# Altium schematic sheet leds.SchDoc
size A; SheetNumber: 4; SheetTotal: 4
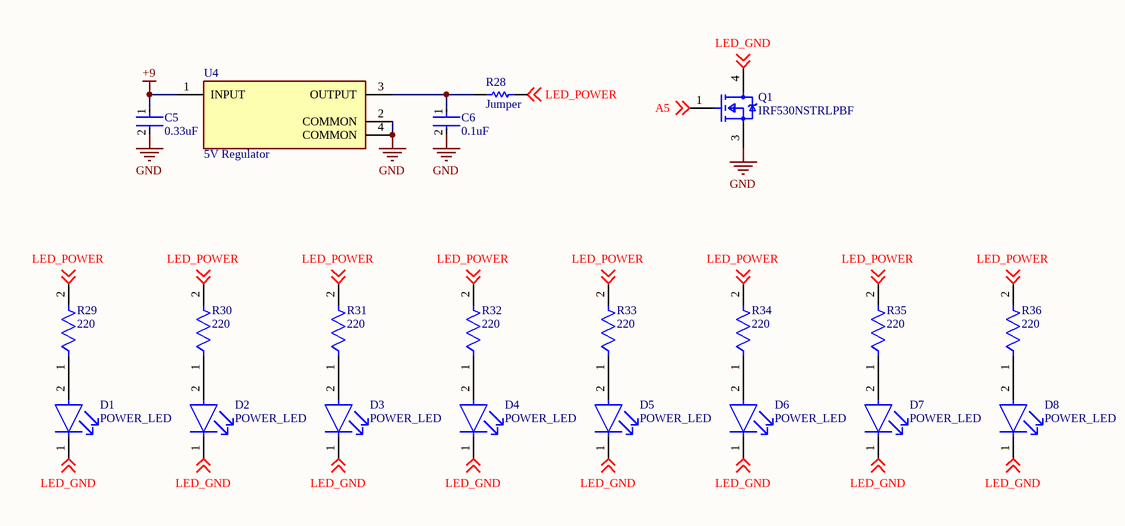
[diagram p0: leds.SchDoc]

## Parts
C5  0.33uF  [FP-C0805C-DN-MFG]
C6  0.1uF  [FP-C0805C-DN-MFG]
D1  POWER_LED  [FP-APTD3216CGCK-MFG]
D2  POWER_LED  [FP-APTD3216CGCK-MFG]
D3  POWER_LED  [FP-APTD3216CGCK-MFG]
D4  POWER_LED  [FP-APTD3216CGCK-MFG]
D5  POWER_LED  [FP-APTD3216CGCK-MFG]
D6  POWER_LED  [FP-APTD3216CGCK-MFG]
D7  POWER_LED  [FP-APTD3216CGCK-MFG]
D8  POWER_LED  [FP-APTD3216CGCK-MFG]
Q1  IRF530NSTRLPBF  [FP-PG-TO263-3-MFG]
R28  Jumper  [RESC2013X70X40NL20T20]
R29  220  [FP-CRCW0805-e3-MFG]
R30  220  [FP-CRCW0805-e3-MFG]
R31  220  [FP-CRCW0805-e3-MFG]
R32  220  [FP-CRCW0805-e3-MFG]
R33  220  [FP-CRCW0805-e3-MFG]
R34  220  [FP-CRCW0805-e3-MFG]
R35  220  [FP-CRCW0805-e3-MFG]
R36  220  [FP-CRCW0805-e3-MFG]
U4  5V Regulator  [FP-KTT0003A-MFG]

## Nets
+9: C5.1 U4.1(INPUT)
GND: C5.2 C6.2 Q1.3(S) U4.2(COMMON) U4.4(COMMON)
A5: Q1.1(G) ; off-sheet A5
LED_GND: D1.1(C) D2.1(C) D3.1(C) D4.1(C) D5.1(C) D6.1(C) D7.1(C) D8.1(C) Q1.4(D) ; off-sheet LED_GND
LED_POWER: R28.2 R29.2 R30.2 R31.2 R32.2 R33.2 R34.2 R35.2 R36.2 ; off-sheet LED_POWER
NetC6_1: C6.1 R28.1 U4.3(OUTPUT)
NetD1_2: D1.2(A) R29.1
NetD2_2: D2.2(A) R30.1
NetD3_2: D3.2(A) R31.1
NetD4_2: D4.2(A) R32.1
NetD5_2: D5.2(A) R33.1
NetD6_2: D6.2(A) R34.1
NetD7_2: D7.2(A) R35.1
NetD8_2: D8.2(A) R36.1

## Library data of the parts
C5 = CMP-1036-04607-3: CAP CER 0.33UF 50V X7R 0805; Manufacturer Part Number: C0805C334K5RACTU; Manufacturer: KEMET; Temperature Coefficient: 30ppm/°C; Value: 0.33 μF; Material: Ceramic; Description: C0805 0.33 μF X7R 30ppm/°C 10.00% 50 V; Tolerance: 0.1; Temperature: -55°C to +125°C; Temperature Range Low: -55°C; Voltage Rating: 50 V; Lead Free: Yes; Mouser Description: Multilayer Ceramic Capacitors MLCC - SMD/SMT 50volts 0.33uF 10% X7R; Automotive: No; Package: C0805C-DN; Temperature Characteristic: X7R; Capacitance: 0.33 μF; Digikey Description: CAP CER 0.33UF 50V X7R 0805; Device Class L3: Ceramic Capacitors; Temperature Range High: +125°C; Category: Cap; Ipc Land Pattern Name: CAPC200125X78; ComponentLink2URL: https://content.kemet.com/datasheets/KEM_C1003_C0G_SMD.pdf; ComponentLink2Description: Datasheet; RoHS: TRUE; Device Class L1: Passive Components; Height: 0.88mm; Octopart: https://octopart.com/c0805c334k5ractu-kemet-10475704; Device Class L2: Capacitors; MPN: C0805C334K5RACTU
C6 = CMP-2007-00279-2: CAP CER 0.1UF 50V X7R 0805; Manufacturer Part Number: C0805C104K5RACTU; Manufacturer: KEMET; Value: 0.10 μF; Description: C0805 0.10 μF X7R 30ppm/°C 10.00% 50 V; Tolerance: 0.1; Temperature Coefficient: 30ppm/°C; Material: Ceramic; Device Class L2: Capacitors; Temperature Range Low: -55°C; Voltage Rating: 50 V; Digikey Description: CAP CER 0.1UF 50V X7R 0805; Category: Cap; ComponentLink2Description: Datasheet; Octopart: https://octopart.com/c0805c104k5ractu-kemet-143926; RoHS: TRUE; ComponentLink2URL: https://content.kemet.com/datasheets/KEM_C1003_C0G_SMD.pdf; Temperature Characteristic: X7R; Temperature: -55°C to +125°C; Height: 0.88mm; Temperature Range High: +125°C; Device Class L1: Passive Components; Automotive: No; Lead Free: Yes; Ipc Land Pattern Name: CAPC200125X78; Device Class L3: Ceramic Capacitors; Mouser Description: Cap Ceramic 0.1uF 50V X7R 10% SMD 2.0 x 1.2 mm 125 C Paper T/R; Capacitance: 0.10 μF; Package: C0805C-DN; MPN: C0805C104K5RACTU
D1-D8 = CMP-2000-05792-2: LED GREEN CLEAR 2SMD; MPN: APTD3216CGCK; Forward Voltage: 2.1V; Forward Current: 20mA; Luminous Intensity: 300mcd; Number of LEDs: 1; Dominant Wavelength: 570nm; Viewing Angle: 50°; Value: Green LED; Lead Free: Lead Free; Lens Color: Clear; Mount: Surface Mount; Package Quantity: 2000; Height: 1.8mm; Number of Pins: 2; Test Current: 20mA; Case Code (Metric): 3216; Case/Package: 1206; Case Code (Imperial): 1206; Illumination Color: Green; Color: Green; Width: 1.6mm; Packaging: Tape and Reel; Min Operating Temperature: -40°C; Lens Style: Clear; Max Operating Temperature: 85°C; Length: 3.2mm; Parameter 2: *
Q1 = CMP-32901-000039-1: MOSFET N-CH 100V 17A D2PAK; Manufacturer: Infineon; Reverse Recovery Time: 93ns; Turn On Delay Time: 9.2ns; Number Of Channels: 1; Gate Charge At Vgs: 37nC @ 10V; Max Junction Temp: +175°C; Drain To Source Resistance: 90mΩ; Pulse Drain Current: 60A; Max Forward Diode Voltage: 1.3V; Threshold Vgs Min: 2V; Threshold Vgs Max: 4V; Depletion Mode: False; Rthja Max: 40°C/W; Reverse Recovery Charge: 320nC; Turn Off Delay Time: 35ns; Gate To Source Voltage: 20V; Power Dissipation: 3.8W; Standoff Height: 0mm; Input Capacitace At Vds: 920pF @ 25V; Height: 5.084mm; RoHS: TRUE; Device Class L2: Transistors; Lead Free: Yes; Automotive: No; Category: Trans; Footprint Url: https://www.infineon.com/cms/en/product/packages/PG-TO263/PG-TO263-3-901/; ComponentLink2Description: Datasheet; Temperature Range Low: -55°C; Drain To Source Voltage: 100V; Temperature: -55°C to +175°C; Device Class L1: Discrete Semiconductors; Number Of N Channels: 1; Continuous Drain Current: 17A; Temperature Range High: +175°C; Digikey Description: MOSFET N-CH 100V 17A D2PAK; Drain To Source Breakdown Voltage: 100V; ComponentLink2URL: https://www.infineon.com/dgdl/irf530nspbf.pdf?fileId=5546d462533600a4015355e38eb4199c; Manufacturer Part Number: IRF530NSTRLPBF; Device Class L3: MOSFETs; Octopart: https://octopart.com/irf530nstrlpbf-infineon-65873402; Package: PG-TO263-3
R28 = CMP-1665-00002-5: Chip Resistor, 0 Ohm, +/- 1%, 0.125 W, -55 to 155 degC, 0805 (2012 Metric), RoHS, Tape and Reel; PartNumber: ERJ-6GEY0R00V; Tolerance: 5%; Resistance: 0 Ohm; REACH SVHC: No SVHC; Min Operating Temperature: -55 degC; Case/Package: 0805; Packaging: Tape and Reel; Package Quantity: 5000; ComponentLink1Description: Manufacturer URL; PackageDescription: 2-Pin Surface Mount Device, Body 2 x 1.25 mm; Mounting Technology: Surface Mount; Max Operating Temperature: 155 degC; Width: 1.25 mm; RoHSCompliant: True; Height: 0.6 mm; ComponentLink1URL: http://www.panasonic.com/; ComponentLink2URL: http://industrial.panasonic.com/cdbs/www-data/pdf/RDA0000/AOA0000C84.pdf; Case Code (Imperial): 0805; DatasheetVersion: 03/2015; Length: 2 mm; Case Code (Metric): 2012; ComponentLink2Description: Datasheet; Radiation Hardening: No; MPN: ERJ-6GEY0R00V
R29-R36 = CMP-2001-03682-2: RES Thick Film, 220Ω, 1%, 0.125W, 100ppm/°C, 0805; MPN: CRCW0805220RFKEA; Max Power Dissipation: 125mW; Voltage Rating: 150V; Resistance: 220R; Packaging: Tape and Reel; Termination: SMD/SMT; Height: 0.45mm; Package Quantity: 10; Width: 0.049inch; Min Operating Temperature: -55°C; Lead Free: Lead Free; Military Standard: Not; Mount: Surface Mount; Max Operating Temperature: 155°C; Voltage Rating (DC): 150V; Composition: Thick Film; Case/Package: 0805; Length: 2mm; Weight: 0.000194oz; Case Code (Metric): 2012; Number of Terminations: 2; Case Code (Imperial): 0805; Radiation Hardening: No; Tolerance: 1%; Features: Automotive AEC-Q200; Power Rating: 125mW; Depth: 1.25mm; Contact Plating: Tin; Temperature Coefficient: 100ppm/°C
U4 = CMP-1685-00014-2: IC REG LIN 5V 1.5A DDPAK/TO263-3; MPN: UA7805CKTTR; Output Type: Fixed; Quiescent Current: 8mA; Dropout Voltage: 2V; Max Input Voltage: 25V; Number of Regulators: 1; Max Output Voltage: 5.2V; Polarity: Positive; Min Output Voltage: 4.8V; Power Supply Rejection Ratio (PSRR): 78dB; Min Input Voltage: 7V; Power Rating: 15W; Number of Pins: 3; Output Voltage: 5V; Max Output Current: 1.5A; Nominal Output Voltage: 5V; Case/Package: TO-263; Width: 9.65mm; REACH SVHC: No SVHC; Max Operating Temperature: 125°C; Output Current: 1.5A; Weight: 0.050897oz; Contact Plating: Tin; Packaging: Tape and Reel; Mount: Surface Mount; Radiation Hardening: No; Lead Free: Lead Free; Min Operating Temperature: 0°C; Length: 10.67mm; Package Quantity: 1; Number of Outputs: 1; Height: 4.83mm